# Altium project WIZ750SR.PrjPcb
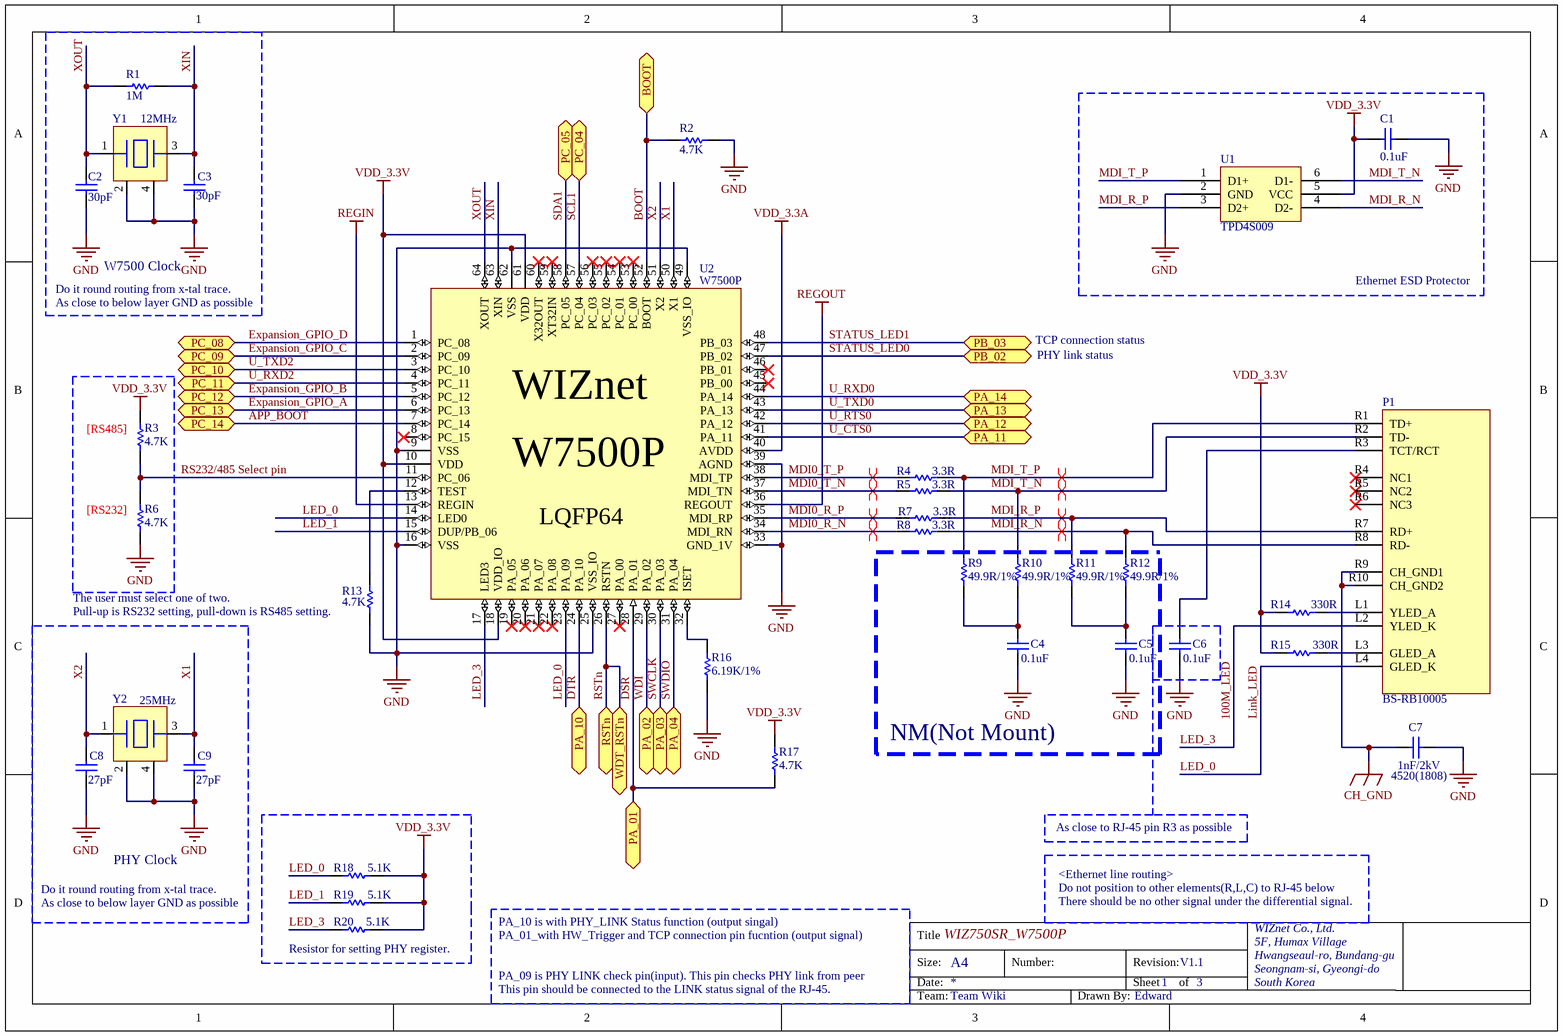
[diagram p0: 1.WIZ750SR_W7500P.SchDoc]
3 sheets, 92 parts. Net scope: flat (ports and power ports of the same name join across sheets).
Board file: WIZ750SR.PcbDoc
Sheets:
  1.WIZ750SR_W7500P.SchDoc
  2.WIZ750SR_Transceiver.SchDoc
  3.WIZ750SR_ETC.SchDoc

## Sheet 1.WIZ750SR_W7500P.SchDoc
size A4; DrawnBy: Peter; Organization: WIZnet Co., Ltd.; Address1: 5F, Humax Village; Address2: Hwangseaul-ro, Bundang-Gu; Address3: Seongnam-Si, Gyeonggi-Do; Address4: South Korea; Team: Wiki

### Parts
C1  0.1uF  [CAP-0402]
C2  30pF  [CAP-0402]
C3  30pF  [CAP-0402]
C4  0.1uF  [CAP-0402]
C5  0.1uF  [CAP-0402]
C6  0.1uF  [CAP-0402]
C7  1nF/2kV  [CAP-1808]
C8  27pF  [CAP-0402]
C9  27pF  [CAP-0402]
P1  BS-RB10005  [RJ45-125BAG1A]
R1  1M  [RES-0402]
R2  4.7K  [RES-0402]
R3  4.7K  [RES-0402]
R4  3.3R  [RES-0402]
R5  3.3R  [RES-0402]
R6  4.7K  [RES-0402]
R7  3.3R  [RES-0402]
R8  3.3R  [RES-0402]
R9  49.9R/1%  [RES-0402]
R10  49.9R/1%  [RES-0402]
R11  49.9R/1%  [RES-0402]
R12  49.9R/1%  [RES-0402]
R13  4.7K  [RES-0402]
R14  330R  [RES-0402]
R15  330R  [RES-0402]
R16  6.19K/1%  [RES-0402]
R17  4.7K  [RES-0402]
R18  5.1K  [RES-0402]
R19  5.1K  [RES-0402]
R20  5.1K  [RES-0402]
U1  TPD4S009  [SOT-23-6L]
U2  W7500P  [W7500-LQFP64]
Y1  12MHz  [OSC-TZ1067B]
Y2  25MHz  [OSC-82J0626]

### Blocks framed on the sheet
W7500 Clock: C2 C3 R1 Y1
Ethernet ESD Protector: C1 U1
PHY Clock: C8 C9 Y2

### Ports
BOOT, PA_01, PA_02, PA_03, PA_04, PA_10, PA_11, PA_12, PA_13, PA_14, PB_02, PB_03, PC_04, PC_05, PC_08, PC_09, PC_10, PC_11, PC_12, PC_13, PC_14, RSTn, WDT_RSTn

### Nets
CH_GND: C7.2 P1.R9(CH_GND1) P1.R10(CH_GND2)
GND: C1.1 C2.1 C3.1 C4.1 C5.1 C6.1 C7.1 C8.1 C9.1 R2.1 R6.1 R13.1 R16.1 U1.2(GND) U2.9(VSS) U2.16(VSS) U2.25(VSS_IO) U2.33(GND_1V) U2.39(AGND) U2.49(VSS_IO) U2.62(VSS) Y1.2 Y1.4 Y2.2 Y2.4
REGIN: U2.13(REGIN)
REGOUT: U2.36(REGOUT)
VDD_3.3A: U2.40(AVDD)
VDD_3.3V: C1.2 R3.2 R14.1 R15.1 R17.1 R18.2 R19.2 R20.2 U1.5(VCC) U2.10(VDD) U2.18(VDD_IO) U2.61(VDD)
100M_LED: P1.L2(YLED_K) R20.1 U2.17(LED3)  [also labelled LED_3]
APP_BOOT: U2.7(PC_14) ; port PC_14
BOOT: R2.2 U2.52(BOOT) ; port BOOT
DSR: R17.2 U2.28(PA_01) ; port PA_01
DTR: U2.24(PA_10) ; port PA_10
Expansion_GPIO_A: U2.6(PC_13) ; port PC_13
Expansion_GPIO_B: U2.5(PC_12) ; port PC_12
Expansion_GPIO_C: U2.2(PC_09) ; port PC_09
Expansion_GPIO_D: U2.1(PC_08) ; port PC_08
LED_0: P1.L4(GLED_K) R18.1 U2.14(LED0) U2.23(PA_09)  [also labelled Link_LED]
LED_1: R19.1 U2.15(DUP/PB_06)
MDI0_R_N: R8.1 U2.34(MDI_RN)
MDI0_R_P: R7.1 U2.35(MDI_RP)
MDI0_T_N: R5.1 U2.37(MDI_TN)
MDI0_T_P: R4.1 U2.38(MDI_TP)
MDI_R_N: P1.R8(RD-) R8.2 R12.2 U1.4(D2-)
MDI_R_P: P1.R7(RD+) R7.2 R11.2 U1.3(D2+)
MDI_T_N: P1.R2(TD-) R5.2 R10.2 U1.6(D1-)
MDI_T_P: P1.R1(TD+) R4.2 R9.2 U1.1(D1+)
RS232/485 Select pin: R3.1 R6.2 U2.11(PC_06)
RSTn: U2.26(RSTN) ; port RSTn, port WDT_RSTn
SCL1: U2.57(PC_04) ; port PC_04
SDA1: U2.58(PC_05) ; port PC_05
STATUS_LED0: U2.47(PB_02) ; port PB_02
STATUS_LED1: U2.48(PB_03) ; port PB_03
SWCLK: U2.30(PA_03) ; port PA_03
SWDIO: U2.31(PA_04) ; port PA_04
U_CTS0: U2.41(PA_11) ; port PA_11
U_RTS0: U2.42(PA_12) ; port PA_12  [project net 485_SEL]
U_RXD0: U2.44(PA_14) ; port PA_14  [project net RXD_RO]
U_RXD2: U2.4(PC_11) ; port PC_11
U_TXD0: U2.43(PA_13) ; port PA_13  [project net TXD_DI]
U_TXD2: U2.3(PC_10) ; port PC_10
WDI: U2.29(PA_02) ; port PA_02
X1: C9.2 U2.50(X1) Y2.3
X2: C8.2 U2.51(X2) Y2.1
XIN: C3.2 R1.2 U2.63(XIN) Y1.3
XOUT: C2.2 R1.1 U2.64(XOUT) Y1.1
NetC4_2: C4.2 R9.1 R10.1
NetC5_2: C5.2 R11.1 R12.1
NetC6_2: C6.2 P1.R3(TCT/RCT)
NetP1_L1: P1.L1(YLED_A) R14.2
NetP1_L3: P1.L3(GLED_A) R15.2
NetR13_2: R13.2 U2.12(TEST)
NetR16_2: R16.2 U2.32(ISET)

Not connected (* = marked no-connect by the designer): P1 R4(NC1)* R5(NC2)* R6(NC3)*; U2 8(PC_15)* 19(PA_05)* 20(PA_06)* 21(PA_07)* 22(PA_08)* 27(PA_00)* 45(PB_00)* 46(PB_01)* 53(PC_00)* 54(PC_01)* 55(PC_02)* 56(PC_03)* 59(XT32IN)* 60(X32OUT)*

### Layout directives
differential pair: MDI0_R_N, MDI0_R_P, MDI0_T_N, MDI0_T_P, MDI_R_N, MDI_R_P, MDI_T_N, MDI_T_P

### Notes on the sheet
- Do it round routing from x-tal trace.
- As close to below layer GND as possible
- TCP connection status
- PHY link status
- (near R3) [RS485]
- (near R6) [RS232]
- The user must select one of two.
- (near R13) Pull-up is RS232 setting, pull-down is RS485 setting.
- NM(Not Mount)
- (near C7) 4520(1808)
- As close to RJ-45 pin R3 as possible
- PA_10 is with PHY_LINK Status function (output singal)
- <Ethernet line routing>
- Do not position to other elements(R,L,C) to RJ-45 below
- There should be no other signal under the differential signal.
- (near R20) Resistor for setting PHY register.
- PA_09 is PHY LINK check pin(input). This pin checks PHY link from peer
- PA_01_with HW_Trigger and TCP connection pin fucntion (output signal)
- Title
- Size:
- Date:
- WIZ750SR_W7500P
- A4
- Number:
- Revision:
- Sheet
- 1
- of
- V1.1
- 3
- WIZnet Co., Ltd.
- 5F, Humax Village
- Hwangseaul-ro, Bundang-gu
- Seongnam-si, Gyeongi-do
- South Korea
- This pin should be connected to the LINK status signal of the RJ-45.
- Team:
- Team Wiki
- Drawn By:
- Edward
- (in symbol W7500P) WIZnet; LQFP64

### Library data of the parts
C1-C6 C8 C9 = CAP-0402: Ceramic CAP 0402(1005)
C7 = CAP-1808: Ceramic CAP 1808(4520)
P1 = RB1-125BAG1A: 10/100 BASE-TX MAGJACK
R1-R20 = RES-0402
U1 = tpd4s009: 6-PIN SOT DBVor DCK Package
U2 = W7500P: WIZnet ARM Cortex-M0, Add PHY
Y1 = OSC-TZ1067B-12MHz: X-tal 12MHz,3.2x2.5 SMD, CL=20pF
Y2 = OSC-82J0626-25MHz: X-tal 25MHz,3.2x2.5 SMD, CL=18pF

## Sheet 2.WIZ750SR_Transceiver.SchDoc
size A4; DrawnBy: Peter; Organization: WIZnet Co., Ltd.; Address1: 5F, Humax Village; Address2: Hwangseaul-ro, Bundang-Gu; Address3: Seongnam-Si, Gyeonggi-Do; Address4: South Korea; Team: Wiki
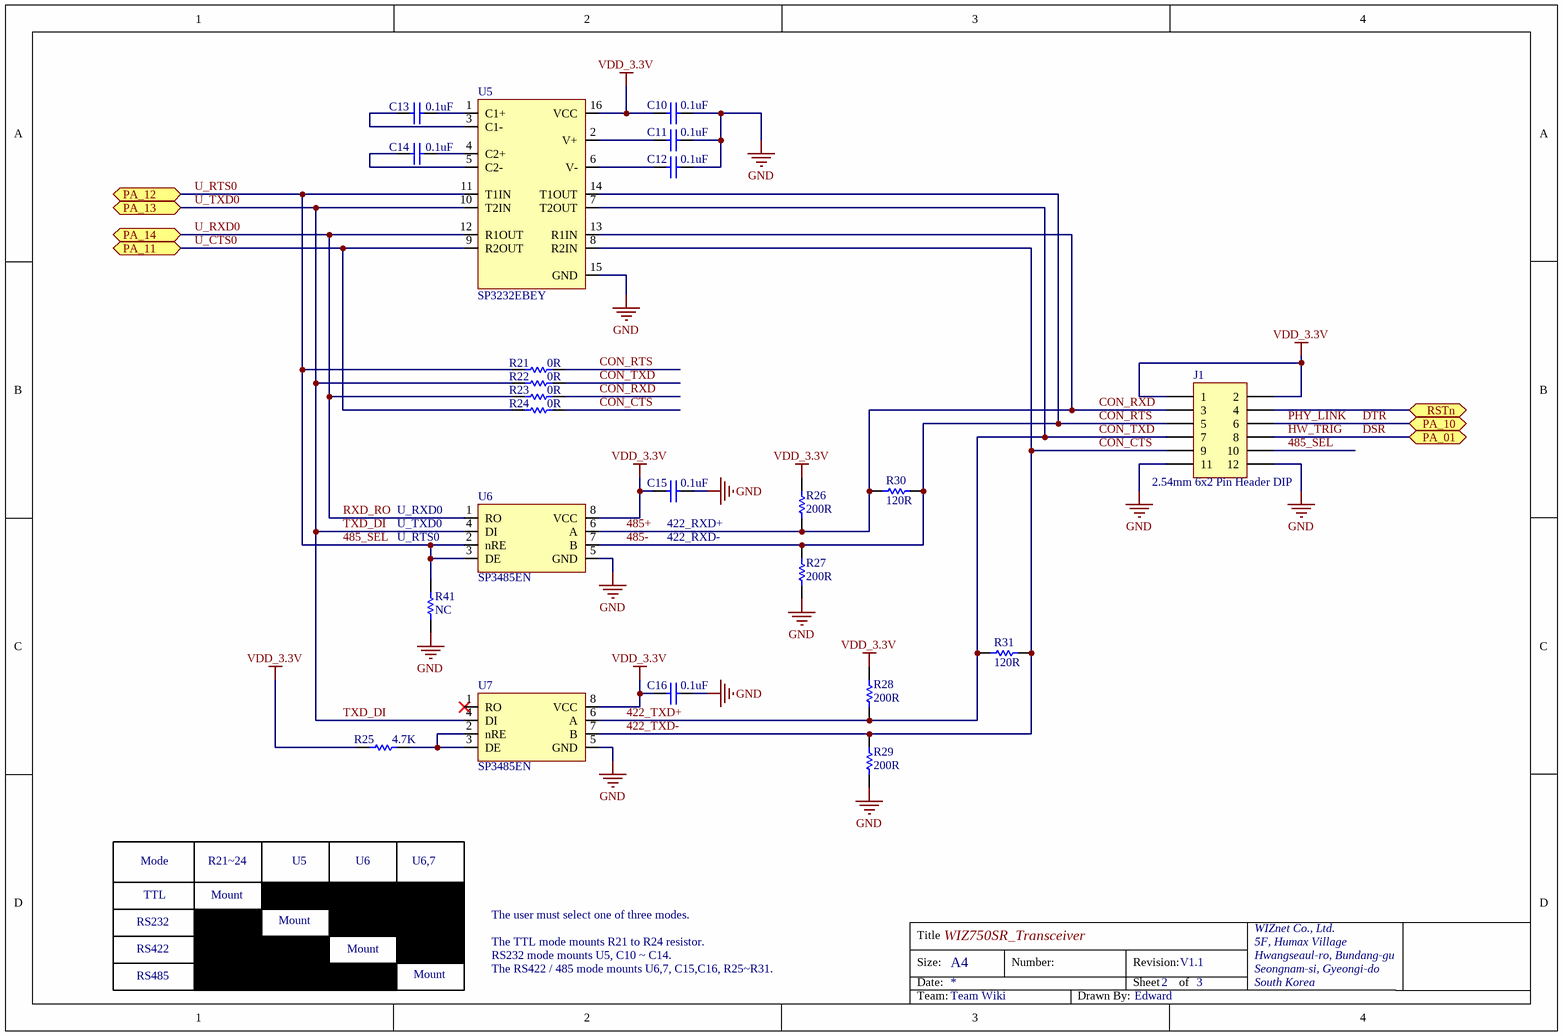
[diagram p1: 2.WIZ750SR_Transceiver.SchDoc]

### Parts
C10  0.1uF  [CAP-0402]
C11  0.1uF  [CAP-0402]
C12  0.1uF  [CAP-0402]
C13  0.1uF  [CAP-0402]
C14  0.1uF  [CAP-0402]
C15  0.1uF  [CAP-0402]
C16  0.1uF  [CAP-0402]
J1  2.54mm 6x2 Pin Header DIP  [IDC-2X6]
R21  0R  [RES-0402]
R22  0R  [RES-0402]
R23  0R  [RES-0402]
R24  0R  [RES-0402]
R25  4.7K  [RES-0402]
R26  200R  [RES-0402]
R27  200R  [RES-0402]
R28  200R  [RES-0402]
R29  200R  [RES-0402]
R30  120R  [RES-0402]
R31  120R  [RES-0402]
R41  NC  [RES-0402]
U5  SP3232EBEY  [TSSOP16(0.65/6.4)]
U6  SP3485EN  [SO-08]
U7  SP3485EN  [SO-08]

### Ports
PA_01, PA_10, PA_11, PA_12, PA_13, PA_14, RSTn

### Nets
GND: C10.1 C11.1 C12.1 C15.1 C16.1 J1.11 J1.12 R27.2 R29.2 R41.2 U5.15(GND) U6.5(GND) U7.5(GND)
VDD_3.3V: C10.2 C15.2 C16.2 J1.1 J1.2 R25.2 R26.1 R28.1 U5.16(VCC) U6.8(VCC) U7.8(VCC)
422_TXD+: J1.7 R22.1 R28.2 R31.2 U5.7(T2OUT) U7.6(A)  [also labelled CON_TXD]
422_TXD-: J1.9 R24.1 R29.1 R31.1 U5.8(R2IN) U7.7(B)  [also labelled CON_CTS]
485+: J1.3 R23.1 R26.2 R30.2 U5.13(R1IN) U6.6(A)  [also labelled CON_RXD]
485-: J1.5 R21.1 R27.1 R30.1 U5.14(T1OUT) U6.7(B)  [also labelled CON_RTS]
485_SEL: J1.10 R21.2 R41.1 U5.11(T1IN) U6.2(nRE) U6.3(DE) ; port PA_12  [also labelled U_RTS0]
DSR: J1.8 ; port PA_01  [also labelled HW_TRIG]
DTR: J1.6 ; port PA_10  [also labelled PHY_LINK]
RSTn: J1.4 ; port RSTn
RXD_RO: R23.2 U5.12(R1OUT) U6.1(RO) ; port PA_14  [also labelled U_RXD0]
TXD_DI: R22.2 U5.10(T2IN) U6.4(DI) U7.4(DI) ; port PA_13  [also labelled U_TXD0]
U_CTS0: R24.2 U5.9(R2OUT) ; port PA_11
NetC11_2: C11.2 U5.2(V+)
NetC12_2: C12.2 U5.6(V-)
NetC13_1: C13.1 U5.1(C1+)
NetC13_2: C13.2 U5.3(C1-)
NetC14_1: C14.1 U5.4(C2+)
NetC14_2: C14.2 U5.5(C2-)
NetR25_1: R25.1 U7.2(nRE) U7.3(DE)

Not connected (* = marked no-connect by the designer): U7 1(RO)*

### Notes on the sheet
- (near U6) U_RXD0
- U_TXD0
- U_RTS0
- (near C15) 422_RXD+
- (near C15) 422_RXD-
- RS232
- Mode
- TTL
- R21~24
- Mount
- U5
- U6
- U6,7
- The user must select one of three modes.
- RS422
- RS485
- The TTL mode mounts R21 to R24 resistor.
- RS232 mode mounts U5, C10 ~ C14.
- The RS422 / 485 mode mounts U6,7, C15,C16, R25~R31.
- Title
- Size:
- Date:
- WIZ750SR_Transceiver
- A4
- Number:
- Revision:
- Sheet
- 2
- of
- V1.1
- 3
- WIZnet Co., Ltd.
- 5F, Humax Village
- Hwangseaul-ro, Bundang-gu
- Seongnam-si, Gyeongi-do
- South Korea
- Team:
- Team Wiki
- Drawn By:
- Edward

### Library data of the parts
C10-C16 = CAP-0402: Ceramic CAP 0402(1005)
J1 = Header 6X2: Header, 6-Pin, Dual row; LatestRevisionDate: 17-Jul-2002; LatestRevisionNote: Re-released for DXP Platform.; Publisher: Altium Limited
R21-R31 R41 = RES-0402
U5 = SP3232EBEY: True +3.0V to +5.5V RS-232 Transceivers TSSOP16
U6 U7 = SP3485EN: RS485 Transceiver

## Sheet 3.WIZ750SR_ETC.SchDoc
size A4; DrawnBy: Peter; Organization: WIZnet Co., Ltd.; Address1: 5F, Humax Village; Address2: Hwangseaul-ro, Bundang-Gu; Address3: Seongnam-Si, Gyeonggi-Do; Address4: South Korea; Team: Wiki
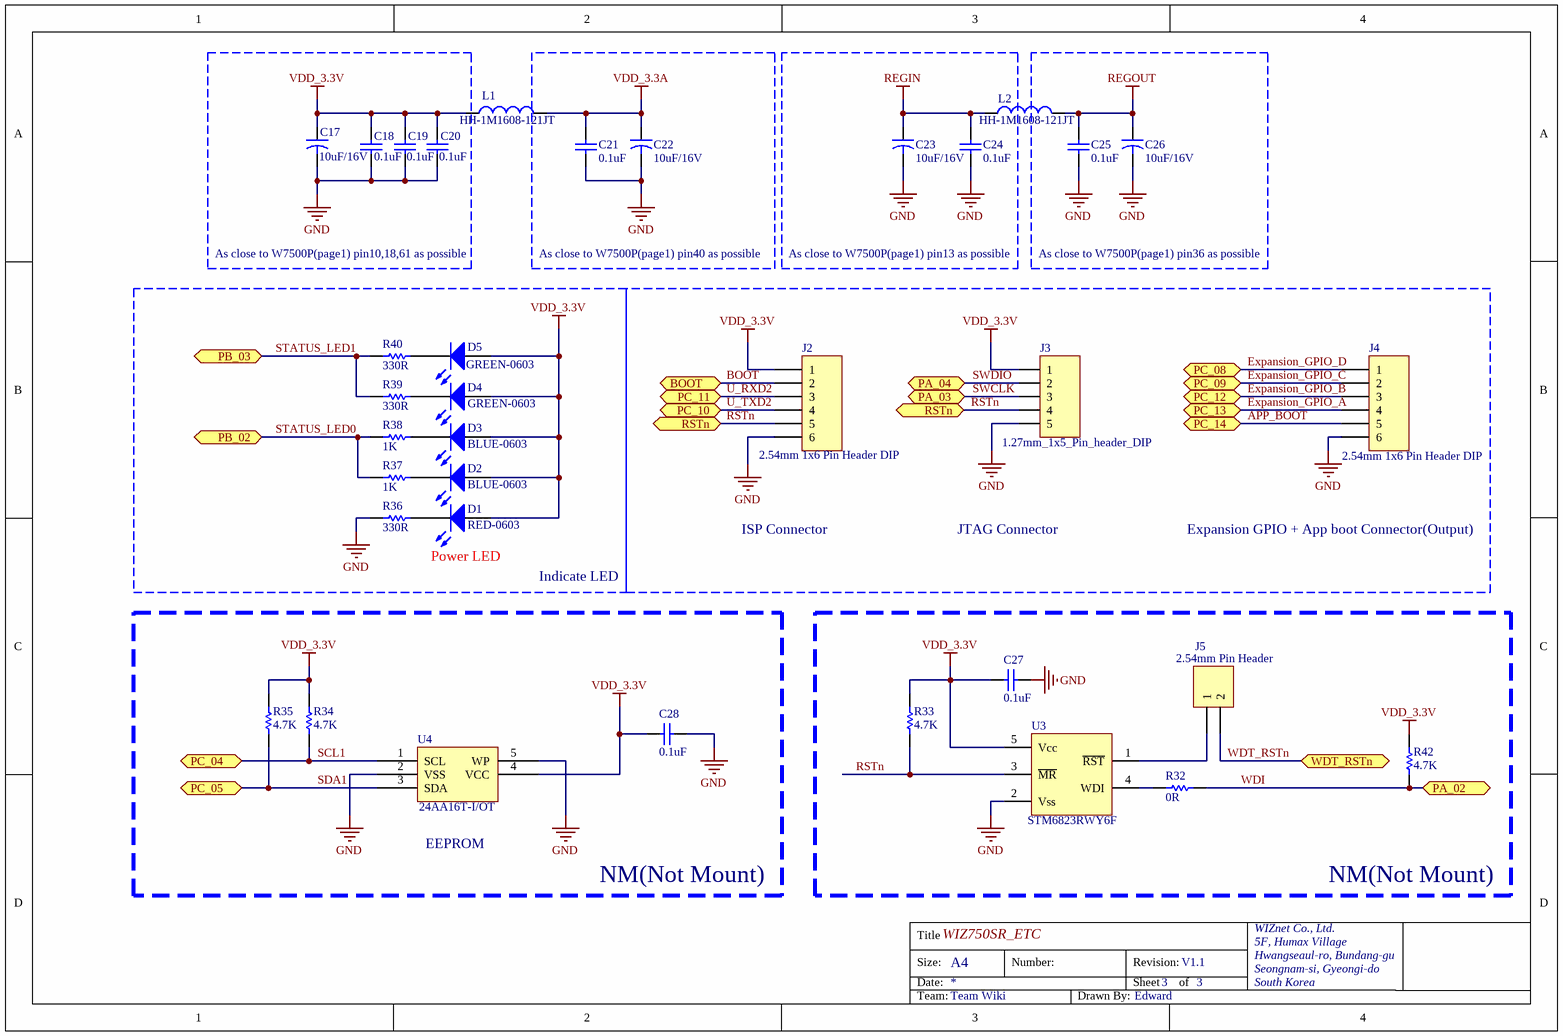
[diagram p2: 3.WIZ750SR_ETC.SchDoc]

### Parts
C17  10uF/16V  [CAP-A Size]
C18  0.1uF  [CAP-0402]
C19  0.1uF  [CAP-0402]
C20  0.1uF  [CAP-0402]
C21  0.1uF  [CAP-0402]
C22  10uF/16V  [CAP-A Size]
C23  10uF/16V  [CAP-A Size]
C24  0.1uF  [CAP-0402]
C25  0.1uF  [CAP-0402]
C26  10uF/16V  [CAP-A Size]
C27  0.1uF  [CAP-0402]
C28  0.1uF  [CAP-0402]
D1  RED-0603  [LED-0603-RED]
D2  BLUE-0603  [LED-0603-BLUE]
D3  BLUE-0603  [LED-0603-BLUE]
D4  GREEN-0603  [LED-0603-GREEN]
D5  GREEN-0603  [LED-0603-GREEN]
J2  2.54mm 1x6 Pin Header DIP  [IDC-1X6]
J3  1.27mm_1x5_Pin_header_DIP  [IDC-1X5(1.27MM)]
J4  2.54mm 1x6 Pin Header DIP  [IDC-1X6]
J5  2.54mm Pin Header  [IDC-1X2]
L1  HH-1M1608-121JT  [IND-0603]
L2  HH-1M1608-121JT  [IND-0603]
R32  0R  [RES-0402]
R33  4.7K  [RES-0402]
R34  4.7K  [RES-0402]
R35  4.7K  [RES-0402]
R36  330R  [RES-0402]
R37  1K  [RES-0402]
R38  1K  [RES-0402]
R39  330R  [RES-0402]
R40  330R  [RES-0402]
R42  4.7K  [RES-0402]
U3  STM6823RWY6F  [SOT-23-5L]
U4  24AA16T-I/OT  [SOT-23-5L]

### Blocks framed on the sheet
As close to W7500P(page1) pin10,18,61 as possible: C17-C20
As close to W7500P(page1) pin40 as possible: C21 C22
As close to W7500P(page1) pin13 as possible: C23 C24
As close to W7500P(page1) pin36 as possible: C25 C26
NM(Not Mount): C28 R34 R35 U4
NM(Not Mount): C27 J5 R32 R33 R42 U3

### Ports
BOOT, PA_02, PA_03, PA_04, PB_02, PB_03, PC_04, PC_05, PC_08, PC_09, PC_10, PC_11, PC_12, PC_13, PC_14, RSTn, WDT_RSTn

### Nets
GND: C17.2 C18.1 C19.1 C20.1 C21.1 C22.2 C23.2 C24.1 C25.1 C26.2 C27.1 C28.1 J2.6 J3.5 J4.6 R36.2 U3.2(Vss) U4.2(VSS) U4.5(WP)
REGIN: C23.1 C24.2 L2.1
REGOUT: C25.2 C26.1 L2.2
VDD_3.3A: C21.2 C22.1 L1.2
VDD_3.3V: C17.1 C18.2 C19.2 C20.2 C27.2 C28.2 D1.1(A) D2.1(A) D3.1(A) D4.1(A) D5.1(A) J2.1 J3.1 L1.1 R33.2 R34.2 R35.2 R42.1 U3.5(Vcc) U4.4(VCC)
APP_BOOT: J4.5 ; port PC_14
BOOT: J2.2 ; port BOOT
Expansion_GPIO_A: J4.4 ; port PC_13
Expansion_GPIO_B: J4.3 ; port PC_12
Expansion_GPIO_C: J4.2 ; port PC_09
Expansion_GPIO_D: J4.1 ; port PC_08
RSTn: J2.5 J3.4 J5.2 R33.1 U3.3(~{MR}) ; port RSTn, port WDT_RSTn  [also labelled WDT_RSTn]
SCL1: R34.1 U4.1(SCL) ; port PC_04
SDA1: R35.1 U4.3(SDA) ; port PC_05
STATUS_LED0: R37.2 R38.2 ; port PB_02
STATUS_LED1: R39.2 R40.2 ; port PB_03
SWCLK: J3.3 ; port PA_03
SWDIO: J3.2 ; port PA_04
U_RXD2: J2.3 ; port PC_11
U_TXD2: J2.4 ; port PC_10
WDI: R32.1 R42.2 ; port PA_02
NetD1_2: D1.2(K) R36.1
NetD2_2: D2.2(K) R37.1
NetD3_2: D3.2(K) R38.1
NetD4_2: D4.2(K) R39.1
NetD5_2: D5.2(K) R40.1
NetJ5_1: J5.1 U3.1(~{RST})
NetR32_2: R32.2 U3.4(WDI)

### Notes on the sheet
- Power LED
- Indicate LED
- ISP Connector
- JTAG Connector
- Expansion GPIO + App boot Connector(Output)
- (near U4) EEPROM
- Title
- Size:
- Date:
- WIZ750SR_ETC
- A4
- Number:
- Revision:
- Sheet
- 3
- of
- V1.1
- WIZnet Co., Ltd.
- 5F, Humax Village
- Hwangseaul-ro, Bundang-gu
- Seongnam-si, Gyeongi-do
- South Korea
- Team:
- Team Wiki
- Drawn By:
- Edward

### Library data of the parts
C17 C22 C23 C26 = CAP-A Size: Tantla CAP A Size EIA/IECQ 3216
C18-C21 C24 C25 C27 C28 = CAP-0402: Ceramic CAP 0402(1005)
D1-D5 = LED-0603
J2 J4 = Header 6: Header, 6-Pin; LatestRevisionDate: 17-Jul-2002; LatestRevisionNote: Re-released for DXP Platform.; Publisher: Altium Limited
J5 = Header 2: Header, 2-Pin; LatestRevisionDate: 17-Jul-2002; LatestRevisionNote: Re-released for DXP Platform.; Publisher: Altium Limited
L1 L2 = IND-0603: Inductor 0603(1608)
R32-R40 R42 = RES-0402
U3 = STM6823: Manual_Reset SOT23-5
U4 = 24AAxxT-i-OT: SOT-23

## Nets that join several sheets
GND: 1.WIZ750SR_W7500P (25 pins), 2.WIZ750SR_Transceiver (13 pins), 3.WIZ750SR_ETC (19 pins)
REGIN: 1.WIZ750SR_W7500P (U2.13), 3.WIZ750SR_ETC (C23.1 C24.2 L2.1)
REGOUT: 1.WIZ750SR_W7500P (U2.36), 3.WIZ750SR_ETC (C25.2 C26.1 L2.2)
VDD_3.3A: 1.WIZ750SR_W7500P (U2.40), 3.WIZ750SR_ETC (C21.2 C22.1 L1.2)
VDD_3.3V: 1.WIZ750SR_W7500P (12 pins), 2.WIZ750SR_Transceiver (11 pins), 3.WIZ750SR_ETC (20 pins)
485_SEL: 1.WIZ750SR_W7500P (U2.42), 2.WIZ750SR_Transceiver (6 pins)
APP_BOOT: 1.WIZ750SR_W7500P (U2.7), 3.WIZ750SR_ETC (J4.5)
BOOT: 1.WIZ750SR_W7500P (R2.2 U2.52), 3.WIZ750SR_ETC (J2.2)
DSR: 1.WIZ750SR_W7500P (R17.2 U2.28), 2.WIZ750SR_Transceiver (J1.8)
DTR: 1.WIZ750SR_W7500P (U2.24), 2.WIZ750SR_Transceiver (J1.6)
Expansion_GPIO_A: 1.WIZ750SR_W7500P (U2.6), 3.WIZ750SR_ETC (J4.4)
Expansion_GPIO_B: 1.WIZ750SR_W7500P (U2.5), 3.WIZ750SR_ETC (J4.3)
Expansion_GPIO_C: 1.WIZ750SR_W7500P (U2.2), 3.WIZ750SR_ETC (J4.2)
Expansion_GPIO_D: 1.WIZ750SR_W7500P (U2.1), 3.WIZ750SR_ETC (J4.1)
RSTn: 1.WIZ750SR_W7500P (U2.26), 2.WIZ750SR_Transceiver (J1.4), 3.WIZ750SR_ETC (5 pins)
RXD_RO: 1.WIZ750SR_W7500P (U2.44), 2.WIZ750SR_Transceiver (R23.2 U5.12 U6.1)
SCL1: 1.WIZ750SR_W7500P (U2.57), 3.WIZ750SR_ETC (R34.1 U4.1)
SDA1: 1.WIZ750SR_W7500P (U2.58), 3.WIZ750SR_ETC (R35.1 U4.3)
STATUS_LED0: 1.WIZ750SR_W7500P (U2.47), 3.WIZ750SR_ETC (R37.2 R38.2)
STATUS_LED1: 1.WIZ750SR_W7500P (U2.48), 3.WIZ750SR_ETC (R39.2 R40.2)
SWCLK: 1.WIZ750SR_W7500P (U2.30), 3.WIZ750SR_ETC (J3.3)
SWDIO: 1.WIZ750SR_W7500P (U2.31), 3.WIZ750SR_ETC (J3.2)
TXD_DI: 1.WIZ750SR_W7500P (U2.43), 2.WIZ750SR_Transceiver (R22.2 U5.10 U6.4 U7.4)
U_CTS0: 1.WIZ750SR_W7500P (U2.41), 2.WIZ750SR_Transceiver (R24.2 U5.9)
U_RXD2: 1.WIZ750SR_W7500P (U2.4), 3.WIZ750SR_ETC (J2.3)
U_TXD2: 1.WIZ750SR_W7500P (U2.3), 3.WIZ750SR_ETC (J2.4)
WDI: 1.WIZ750SR_W7500P (U2.29), 3.WIZ750SR_ETC (R32.1 R42.2)